# EasyEDA Pro project 封装.eprj

# Board 封装
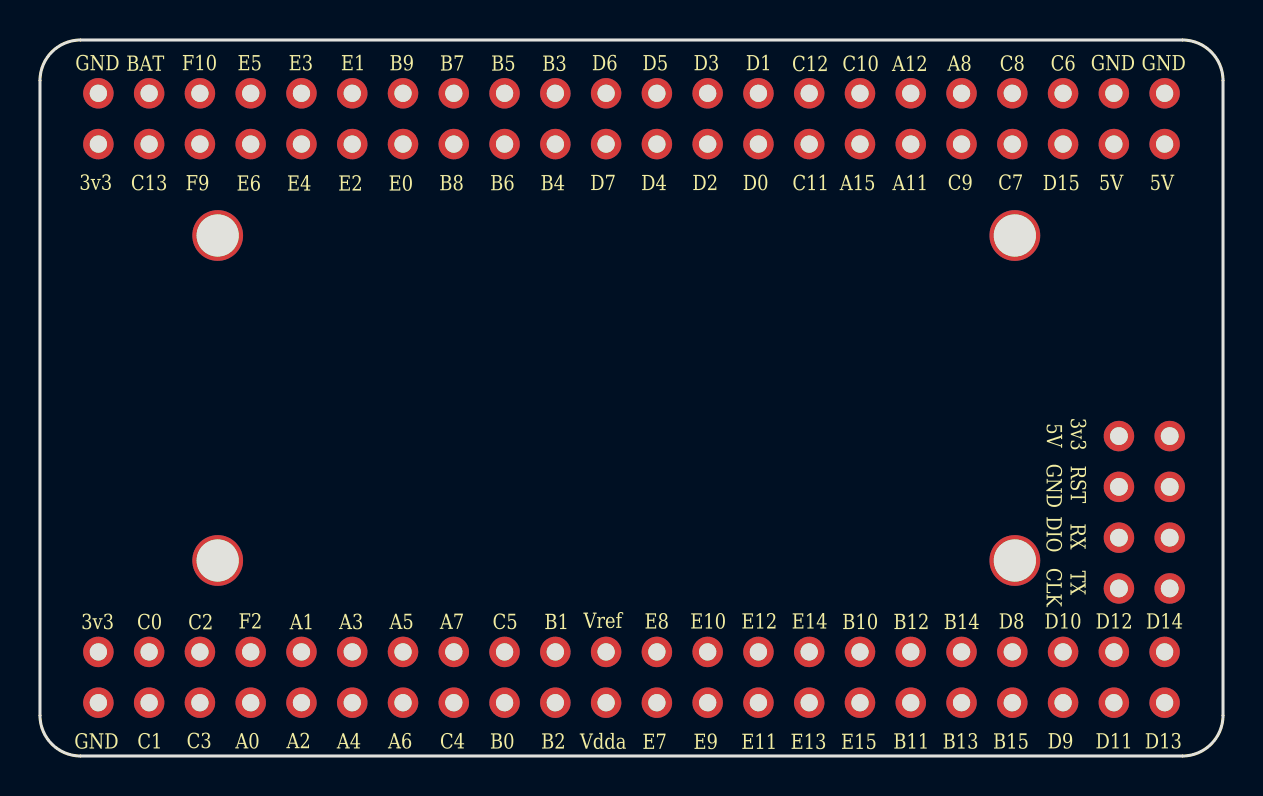
[diagram p0: board, top side]
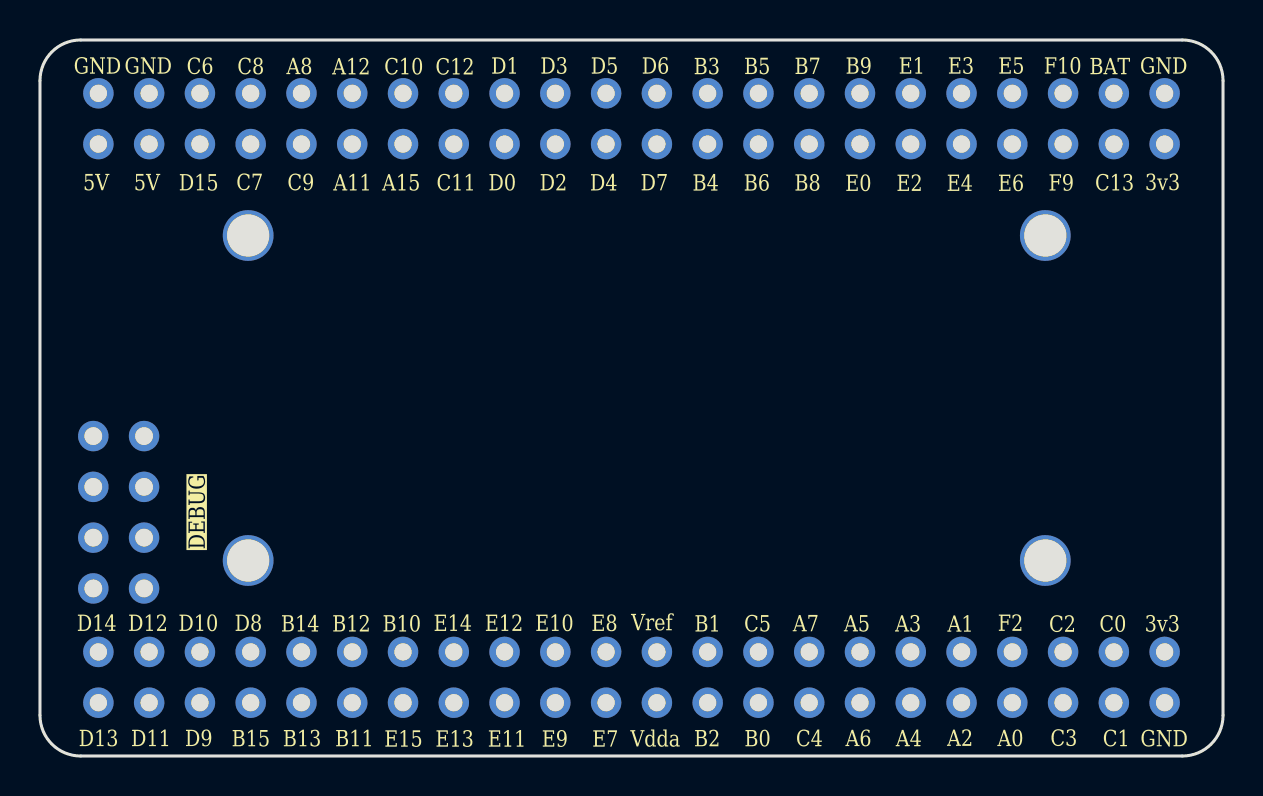
[diagram p1: board, bottom side, seen from below]

Outline 59.18 x 35.81 mm; copper layers: Top Layer, Inner1, Inner2, Bottom Layer. Coordinates in mm from the lower left corner of the outline.
Outline path: 0,33.78 0,2.03 arc(0.6,0.6) 2.03,0 57.15,0 arc(58.59,0.6) 59.18,2.03 59.18,33.78 arc(58.59,35.22) 57.15,35.81 2.03,35.81 arc(0.6,35.22) 0,33.78
Stack: SUBSTRATE1 0.32mm FR-4 er 4.8 / SUBSTRATE2 0.32mm FR-4 er 4.8 / SUBSTRATE3 0.32mm FR-4 er 4.8

## Placement (name value [footprint] x y rotation side)
NOREF  -  [Pad_ie4]  48.77 26.04 0 top
NOREF#2  -  [Pad_ie3]  48.77 9.78 0 top
NOREF#3  -  [Pad_ie2]  8.89 26.04 0 top
NOREF#4  -  [Pad_ie1]  8.89 9.78 0 top
P1  Header-Male-2.54_2x4  [header 2*4]  56.52 8.38 90 top
P2  -  [Header 2x22]  29.59 3.94 90 top
P3  -  [Header 2x22]  29.59 31.88 90 top

## Footprints (pads in the part's own frame, mm; a bottom-side part is the same pattern mirrored in y, then rotated)
header 2*4
  round 1.524 hole 0.889: 1(0,0) 2(0,2.54) 3(2.54,0) 4(2.54,2.54) 5(5.08,0) 6(5.08,2.54) 7(7.62,0) 8(7.62,2.54)
Header 2x22
  round 1.524 hole 0.864: 1(-1.27,26.67) 2(1.27,26.67) 3(-1.27,24.13) 4(1.27,24.13) 5(-1.27,21.59) 6(1.27,21.59) 7(-1.27,19.05) 8(1.27,19.05) 9(-1.27,16.51) 10(1.27,16.51) 11(-1.27,13.97) 12(1.27,13.97) 13(-1.27,11.43) 14(1.27,11.43) 15(-1.27,8.89) 16(1.27,8.89) 17(-1.27,6.35) 18(1.27,6.35) 19(-1.27,3.81) 20(1.27,3.81) 21(-1.27,1.27) 22(1.27,1.27) 23(-1.27,-1.27) 24(1.27,-1.27) 25(-1.27,-3.81) 26(1.27,-3.81) 27(-1.27,-6.35) 28(1.27,-6.35) 29(-1.27,-8.89) 30(1.27,-8.89) 31(-1.27,-11.43) 32(1.27,-11.43) 33(-1.27,-13.97) 34(1.27,-13.97) 35(-1.27,-16.51) 36(1.27,-16.51) 37(-1.27,-19.05) 38(1.27,-19.05) 39(-1.27,-21.59) 40(1.27,-21.59) 41(-1.27,-24.13) 42(1.27,-24.13) 43(-1.27,-26.67) 44(1.27,-26.67)
Pad_ie1
  round 2.54 hole 2.108: 1(0,0)
Pad_ie2
  round 2.54 hole 2.108: 1(0,0)
Pad_ie3
  round 2.54 hole 2.108: 1(0,0)
Pad_ie4
  round 2.54 hole 2.108: 1(0,0)

## Nets
3V3: P1.7 P2.2 P3.1
5V: P1.8 P3.41 P3.43
GND: NOREF.1 NOREF#2.1 NOREF#3.1 NOREF#4.1 P1.6 P2.1 P3.2 P3.42 P3.44
VDDA: P2.21
BAT: P3.4
BOOT: P3.15
EXT_ADC_CH1: P2.7
EXT_ADC_CH2: P2.10
EXT_I2C_SCL: P3.38
EXT_I2C_SDA: P3.35
EXT_RX: P3.29
EXT_SPI1_MISO: P2.13
EXT_SPI1_MOSI: P2.16
EXT_SPI1_SCK: P2.14
EXT_SPI2_MISO: P2.36
EXT_SPI2_MOSI: P2.37
EXT_SPI2_SCK: P2.35
EXT_TX: P3.32
LED1: P2.4
LED2: P2.3
LED3: P2.6
NRST: P1.5
PA2: P2.9
PA3: P2.12
PA4: P2.11
PA8: P3.36
PA9: P1.1
PA10: P1.3
PA11: P3.33
PA12: P3.34
PA13: P1.4
PA14: P1.2
PA15: P3.31
PB0: P2.17
PB1: P2.20
PB2: P2.19
PB3: P3.20
PB4: P3.19
PB5: P3.18
PB6: P3.17
PB7: P3.16
PB9: P3.14
PB10: P2.32
PB11: P2.33
PB12: P2.34
PC3: P2.5
PC4: P2.15
PC5: P2.18
PC6: P3.40
PC7: P3.37
PC12: P3.30
PC13: P3.3
PD0: P3.27
PD1: P3.28
PD2: P3.25
PD3: P3.26
PD4: P3.23
PD5: P3.24
PD6: P3.22
PD7: P3.21
PD8: P2.38
PD9: P2.39
PD10: P2.40
PD11: P2.41
PD12: P2.42
PD13: P2.43
PD14: P2.44
PD15: P3.39
PE0: P3.13
PE1: P3.12
PE2: P3.11
PE3: P3.10
PE4: P3.9
PE5: P3.8
PE6: P3.7
PE7: P2.23
PE8: P2.24
PE9: P2.25
PE10: P2.26
PE11: P2.27
PE12: P2.28
PE13: P2.29
PE14: P2.30
PE15: P2.31
PF2: P2.8
PF9: P3.5
PF10: P3.6
VREF: P2.22

## Text on the board
Bottom Silkscreen Layer: DEBUG | 3v3 | GND | C1 | C0 | C13 | BAT | C3 | C2 | F9 | F10 | E5 | E6 | F2 | A0 | E3 | A1 | A2 | E4 | E1 | E2 | A4 | A3 | B9 | A6 | E0 | A5 | C4 | B7 | B8 | A7 | B0 | C5 | B5 | B6 | B1 | B2 | B3 | B4 | D6 | D7 | Vref | Vdda | E7 | E8 | D5 | D4 | E9 | D3 | D2 | E10 | D1 | D0 | E11 | E12 | C11 | E13 | C12 | E14 | E15 | C10 | B10 | A15 | B11 | A11 | B12 | A12 | C9 | A8 | B13 | B14 | C8 | C7 | D8 | B15 | C6 | D9 | D15 | D10 | 5V | D11 | D12 | D13 | D14
Top Silkscreen Layer: GND | 3v3 | BAT | C13 | C0 | C1 | F10 | F9 | C3 | C2 | A0 | E6 | E5 | F2 | A2 | E4 | E3 | A1 | A4 | E2 | A3 | E1 | A6 | E0 | A5 | B9 | B8 | A7 | C4 | B7 | B0 | B6 | B5 | C5 | B4 | B2 | B3 | B1 | Vdda | Vref | D7 | D6 | D4 | E7 | D5 | E8 | E10 | D2 | E9 | D3 | E11 | E12 | D0 | D1 | E13 | E14 | C12 | C11 | A15 | E15 | B10 | C10 | A12 | A11 | B11 | B12 | B13 | B14 | A8 | C9 | B15 | C7 | D8 | C8 | D15 | D10 | D9 | C6 | D11 | D12 | 5V | D13 | D14 | DIO | CLK | TX | RX | RST
